# EAGLE design mini-meter-revd (EAGLE 6.5.0)
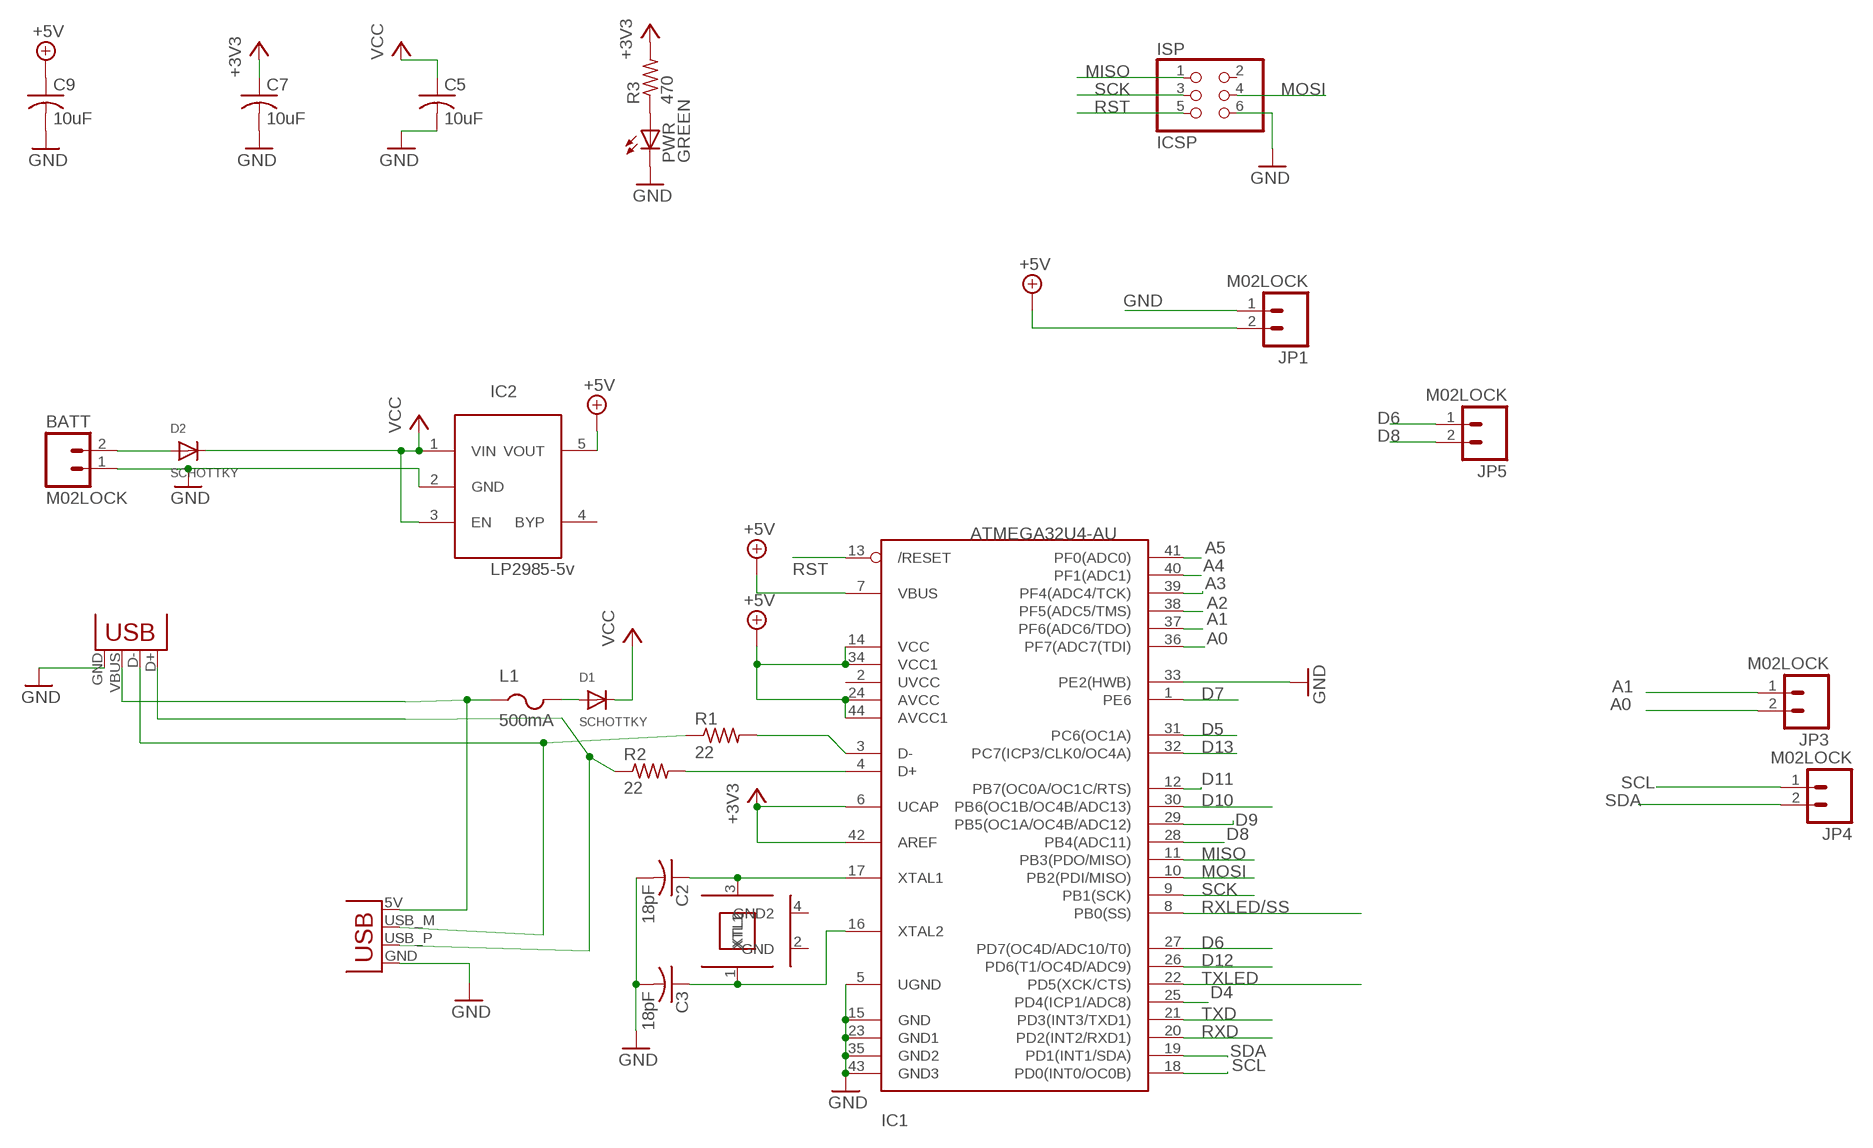
[diagram p0: schematic, sheet 1]

## Parts
BATT  M02LOCK  [1X02_LOCK]
C2  18pF  C-USC0805K  [C0805K]
C3  18pF  C-USC0805K  [C0805K]
C5  10uF  C-USC0805K  [C0805K]
C7  10uF  C-USC0805K  [C0805K]
C9  10uF  C-USC0805K  [C0805K]
D1  SCHOTTKY  DIODESOD-123  [SOD-123]
D2  SCHOTTKY  DIODESOD-123  [SOD-123]
IC1  ATMEGA32U4-AU  [TQFP44]
IC2  LP2985-5v  LP298XS  [SOT23-5L]
ISP  ICSP  PINHD-2X3  [2X03]
JP1  M02LOCK  [1X02_LOCK]
JP3  M02LOCK  [1X02_LOCK]
JP4  M02LOCK  [1X02_LOCK]
JP5  M02LOCK  [1X02_LOCK]
L1  500mA  PTCFUSE-1206  [R1206]
P1  USBPCB  [USB-A-PCB]
PWR  GREEN  LEDCHIPLED_0805  [CHIPLED_0805]
R1  22  R-US_R0805  [R0805]
R2  22  R-US_R0805  [R0805]
R3  470  R-US_R0805  [R0805]
X1  USB-MICROB  [USB-MICROB]
XTL1  16MHz  CRYSTAL-GND3X2  [CRYSTAL-SMD-3X2]

## Nets
+3V3: C7.1 IC1.6(UCAP) IC1.42(AREF) R3.2
+5V: C9.1 IC1.7(VBUS) IC1.14(VCC) IC1.24(AVCC) IC1.34(VCC1) IC1.44(AVCC1) IC2.5(VOUT) JP1.2
A0: IC1.36(PF7(ADC7(TDI)) JP3.2
A1: IC1.37(PF6(ADC6/TDO)) JP3.1
A2: IC1.38(PF5(ADC5/TMS))
A3: IC1.39(PF4(ADC4/TCK))
A4: IC1.40(PF1(ADC1))
A5: IC1.41(PF0(ADC0))
D4: IC1.25(PD4(ICP1/ADC8))
D5: IC1.31(PC6(OC1A))
D6: IC1.27(PD7(OC4D/ADC10/T0)) JP5.1
D7: IC1.1(PE6)
D8: IC1.28(PB4(ADC11)) JP5.2
D9: IC1.29(PB5(OC1A/OC4B/ADC12))
D10: IC1.30(PB6(OC1B/OC4B/ADC13))
D11: IC1.12(PB7(OC0A/OC1C/RTS))
D12: IC1.26(PD6(T1/OC4D/ADC9))
D13: IC1.32(PC7(ICP3/CLK0/OC4A))
GND: BATT.1 C2.2 C3.2 C5.2 C7.2 C9.2 IC1.5(UGND) IC1.15(GND) IC1.23(GND1) IC1.33(PE2(HWB)) IC1.35(GND2) IC1.43(GND3) IC2.2(GND) ISP.6 JP1.1 P1.GND PWR.C X1.GND
MISO: IC1.11(PB3(PDO/MISO)) ISP.1
MOSI: IC1.10(PB2(PDI/MISO)) ISP.4
N$1: PWR.A R3.1
N$2: P1.USB_P(D+) R2.1 X1.D+
N$3: IC1.3(D-) R1.2
N$4: IC1.4(D+) R2.2
N$5: P1.USB_M(D-) R1.1 X1.D-
N$7: BATT.2 D2.A
N$8: C2.1 IC1.17(XTAL1) XTL1.3(XTL2)
N$9: C3.1 IC1.16(XTAL2) XTL1.1(XTL1)
N$11: D1.A L1.2
RST: IC1.13(/RESET) ISP.5
RXD: IC1.20(PD2(INT2/RXD1))
RXLED/SS: IC1.8(PB0(SS))
SCK: IC1.9(PB1(SCK)) ISP.3
SCL: IC1.18(PD0(INT0/OC0B)) JP4.1
SDA: IC1.19(PD1(INT1/SDA)) JP4.2
TXD: IC1.21(PD3(INT3/TXD1))
TXLED: IC1.22(PD5(XCK/CTS))
VBUS: L1.1 P1.5V(VBUS) X1.VBUS
VCC: C5.1 D1.C D2.C IC2.1(VIN) IC2.3(EN)
Unconnected: IC1.2(UVCC) IC2.4(BYP) ISP.2 XTL1.2(GND) XTL1.4(GND2)

## Library data of the parts
BATT JP1 JP3-JP5 = SparkFun-Connectors:M02: Standard 2-pin 0.1" header. Use with - straight break away headers ( PRT-00116) - right angle break away headers (PRT-00553) - swiss pins (PRT-00743) - machine pins (PRT-00117) - female headers (PRT-00115) Molex polarized connector foot print use with: PRT-08233 with associated crimp pins and housings. 2.54_SCREWTERM for use with PRT-10571. 3.5mm Screw Terminal footprints for PRT-08084 5mm Screw Terminal footprints for use with PRT-08433
C2 C3 C5 C7 C9 = adafruit:C-US: CAPACITOR, American symbol
D1 D2 = adafruit:DIODE: Diode SMADIODE - SMA Surface Mount Package 20V 1A Schottky Diode Digikey: 641-1014-6-ND DO-1N4148 - Through Hole Small Current Diode SOD-123 20V 1 A (.5mV Vf) Schottky Diode - Digikey: MBRX120TPMSCT-ND SOD-323 10V 570mA (.38mV Vf, 3ns) Schottky Diode - Digikey: ZLLS410CT-ND SOD-523 30V 30mA Schottky Diode (RB751S-40TE61) - Digikey: RB751S-40TE61CT-ND SOT23-R/W - SOT23 Package (R = Solder Paste/Reflow Ovens, W = Hand-Soldering) BAT54Film 40V 300mA - Digikey: 497-7162-1-ND
IC1 = adaprog:ATMEGA32U4
IC2 = adafruit:LP298X
ISP = pinhead:PINHD-2X3: PIN HEADER
L1 = adafruit:PTCFUSE: PTC fuses, resettable thermistors
P1 = freetronics-master-v1:USB: USB Connectors USB-B-PTH is fully proven SKU : PRT-00139 USB-miniB is fully proven SKU : PRT-00587 USB-A-PCB is untested. USB-A-H is throughly reviewed, but untested. Spark Fun Electronics SKU : PRT-00437 USB-B-SMT is throughly reviewed, but untested. Needs silkscreen touching up. USB-A-S has not been used/tested USB-MB-H has not been used/tested
PWR = adafruit:LED: LED OSRAM: - CHIPLED LG R971, LG N971, LY N971, LG Q971, LY Q971, LO R971, LY R971 LH N974, LH R974 LS Q976, LO Q976, LY Q976 LO Q996 - Hyper CHIPLED LW Q18S LB Q993, LB Q99A, LB R99A - SideLED LS A670, LO A670, LY A670, LG A670, LP A670 LB A673, LV A673, LT A673, LW A673 LH A674 LY A675 LS A676, LA A676, LO A676, LY A676, LW A676 LS A679, LY A679, LG A679 - Hyper Micro SIDELED® LS Y876, LA Y876, LO Y876, LY Y876 LT Y87S - SmartLED LW L88C, LW L88S LB L89C, LB L89S, LG L890 LS L89K, LO L89K, LY L89K LS L896, LA L896, LO L896, LY L896 - TOPLED LS T670, LO T670, LY T670, LG T670, LP T670 LSG T670, LSP T670, LSY T670, LOP T670, LYG T670 LG T671, LOG T671, LSG T671 LB T673, LV T673, LT T673, LW T673 LH T674 LS T676, LA T676, LO T676, LY T676, LB T676, LH T676, LSB T676, LW T676 LB T67C, LV T67C, LT T67C, LS T67K, LO T67K, LY T67K, LW E67C LS E67B, LA E67B, LO E67B, LY E67B, LB E67C, LV E67C, LT E67C LW T67C LS T679, LY T679, LG T679 LS T770, LO T770, LY T770, LG T770, LP T770 LB T773, LV T773, LT T773, LW T773 LH T774 LS E675, LA E675, LY E675, LS T675 LS T776, LA T776, LO T776, LY T776, LB T776 LHGB T686 LT T68C, LB T68C - Hyper Mini TOPLED® LB M676 - Mini TOPLED Santana® LG M470 LS M47K, LO M47K, LY M47K Source: http://www.osram.convergy.de/
R1-R3 = adafruit:R-US_: RESISTOR, American symbol
X1 = SparkFun:USB: USB Connectors USB-B-PTH is fully proven SKU : PRT-00139 USB-miniB is fully proven SKU : PRT-00587 USB-A-PCB is untested. USB-A-H is throughly reviewed, but untested. Spark Fun Electronics SKU : PRT-00437 USB-B-SMT is throughly reviewed, but untested. Needs silkscreen touching up. USB-A-S has not been used/tested USB-MB-H has not been used/tested
XTL1 = freetronics-jon:CRYSTAL-GND

## Net classes
0 default: width 0.152 mm, drill 0.241 mm, clearance 0.152 mm

## Board
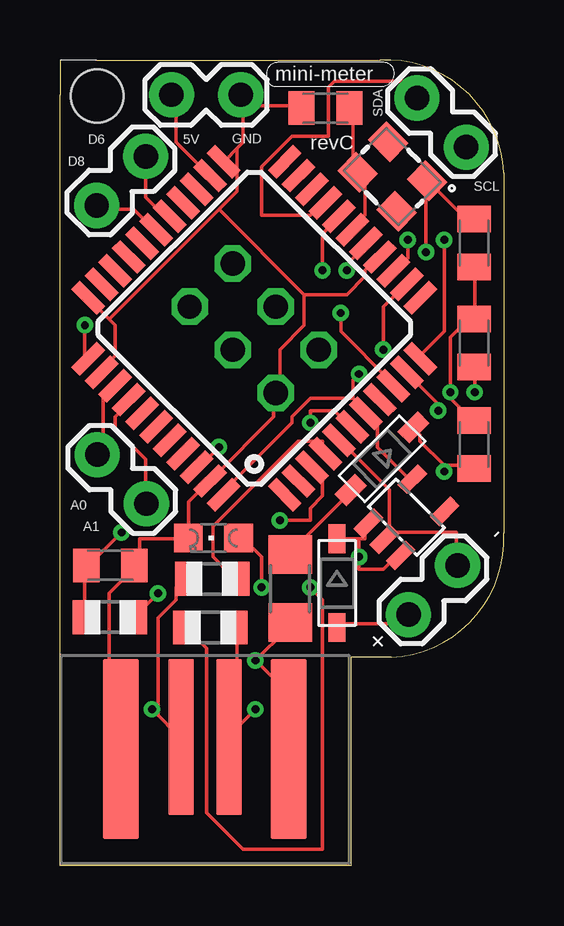
[diagram p1: board, top side]
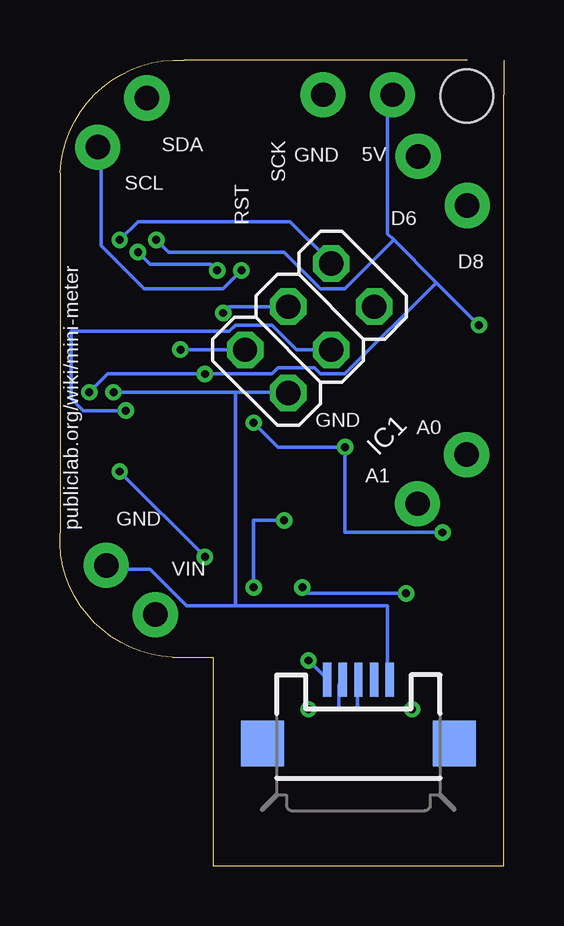
[diagram p2: board, bottom side, seen from below]

Size 18.52 x 33.58 mm. Coordinates in mm from the lower left corner, seen from the top.
Outline: 1.52,33.58 13.34,33.58 arc-90 18.52,28.88 18.52,13.87 arc-90 13.82,8.69 12.14,8.69 12.14,0 0,0 0,32.13 0,33.58
Copper layers (1*16): Top 0.0356mm / dielectric 1.5011mm / Bottom 0.0356mm
Design rules "LaenPCBOrder": minimum track width 6mil, minimum drill 13mil, track to track 6mil, track to pad 6mil, pad to pad 6mil, via to via 6mil, smd to smd 6mil, copper to edge 15mil, drill to drill 6mil, minimum pad ring 7mil, minimum via ring 7mil, stop-mask expansion 3mil, vias tented up to drill 0mil, thermal gap 10mil
Holes 2.2 mm at 1.55,32.08

### Footprints (pad centres in the part's own frame; a part is rotated, then mirrored left to right if it is on the bottom)
1X02_LOCK = drill 1.016 pad 1.88: 1 -0.178,0; 2 2.718,0
C0805K = smd 1.1 x 1.4: 1 -1,0; 2 1,0
SOD-123 = smd 1.2 x 0.7: A 1.85,0; C -1.85,0
TQFP44 = smd 1.5 x 0.5: 1 -5.8,4; 2 -5.8,3.2; 3 -5.8,2.4; 4 -5.8,1.6; 5 -5.8,0.8; 6 -5.8,0; 7 -5.8,-0.8; 8 -5.8,-1.6; 9 -5.8,-2.4; 10 -5.8,-3.2; 11 -5.8,-4; 23 5.8,-4; 24 5.8,-3.2; 25 5.8,-2.4; 26 5.8,-1.6; 27 5.8,-0.8; 28 5.8,0; 29 5.8,0.8; 30 5.8,1.6; 31 5.8,2.4; 32 5.8,3.2; 33 5.8,4 | smd 0.5 x 1.5: 12 -4,-5.8; 13 -3.2,-5.8; 14 -2.4,-5.8; 15 -1.6,-5.8; 16 -0.8,-5.8; 17 0,-5.8; 18 0.8,-5.8; 19 1.6,-5.8; 20 2.4,-5.8; 21 3.2,-5.8; 22 4,-5.8; 34 4,5.8; 35 3.2,5.8; 36 2.4,5.8; 37 1.6,5.8; 38 0.8,5.8; 39 0,5.8; 40 -0.8,5.8; 41 -1.6,5.8; 42 -2.4,5.8; 43 -3.2,5.8; 44 -4,5.8
SOT23-5L = smd 0.55 x 1.2: 1 -0.95,-1.3; 2 0,-1.3; 3 0.95,-1.3; 4 0.95,1.3; 5 -0.95,1.3
2X03 = drill 1.016 octagon: 1 -2.54,-1.27; 2 -2.54,1.27; 3 0,-1.27; 4 0,1.27; 5 2.54,-1.27; 6 2.54,1.27
R1206 = smd 1.6 x 1.803: 1 -1.422,0; 2 1.422,0
USB-A-PCB = smd 7.5 x 1.5: 5V -0.2,-3.5; GND -0.2,3.5 | smd 6.5 x 1.067: USB_M 0.3,-1; USB_P 0.3,1
CHIPLED_0805 = smd 1.2 x 1.2: A 0,-1.05; C 0,1.05
R0805 = smd 1.1 x 1.4: 1 -1,0; 2 1,0
USB-MICROB = smd 0.35 x 1.4: D+ 0,2.65; D- -0.65,2.65; GND 1.3,2.65; ID 0.65,2.65; VBUS -1.3,2.65 | smd 1.8 x 1.9: MT1 -4,0; MT2 4,0
CRYSTAL-SMD-3X2 = smd 1.3 x 1.1: 1 -1.15,-0.9; 2 1.15,-0.9; 3 1.15,0.9; 4 -1.15,0.9

### Placement (x,y rotation side)
BATT  16.46,12.4 225 top
C2  11.07,31.57 180 top
C3  17.27,25.96 270 top
C5  17.27,17.55 90 top
C7  2.11,12.52 0 top
C9  17.27,21.79 90 top
D1  13.44,16.97 225 top
D2  11.56,11.79 270 top
IC1  8.1,22.4 135 top
IC2  14.45,14.53 315 top
ISP  8.1,22.4 225 bottom
JP1  7.37,32.13 180 top
JP3  3.48,15.21 135 top
JP4  16.81,30.07 135 top
JP5  3.45,29.44 225 top
L1  9.6,11.56 90 top
P1  6.05,5.08 90 top
PWR  6.4,13.67 90 top
R1  6.27,9.93 180 top
R2  6.35,11.96 0 top
R3  2.08,10.36 180 top
X1  6.07,5.11 0 bottom
XTL1  13.87,28.73 135 top

### Tracks (layer width: path | path; a pad name or v marks a point on that pad's centre or on a via)
+3V3  (via drill 0.33)
  Top 0.152: R3.2 1.04,10.59 1.04,12.37 C7.1 1.3,12.62 v2.57,13.89 | v6.63,17.45 5.87,16.69 IC1.42 | v10.44,18.47 10.44,18.97 11.46,18.97 11.96,18.47 IC1.6
  Bottom 0.152: v2.57,13.89 6.63,13.89 v6.63,17.45 9.42,17.45 v10.44,18.47
+5V  (via drill 0.33)
  Top 0.152: IC2.5 14.5,16.18 13.23,17.45 13.23,18.47 12.98,18.72 IC1.7 12.73,18.97 12.22,19.48 | v17.3,19.74 17.3,20.75 C9.1 | v12.47,20.5 12.22,20.24 12.22,19.48 | 12.22,19.48 10.44,19.48 9.68,18.72 9.68,18.47 6.88,15.67 IC1.44 | v1.04,22.53 1.04,21.26 IC1.34 | v14.5,26.09 14.5,25.32 14,24.82 IC1.14 | IC1.24 6.12,28.88 4.85,30.15 4.85,31.93 JP1.2
  Bottom 0.152: v17.3,19.74 16.54,20.5 v12.47,20.5 9.68,20.5 9.42,20.75 7.9,20.75 7.65,20.5 6.63,20.5 2.82,24.31 | 4.6,26.09 4.85,26.34 4.85,31.93 JP1.2 | 4.6,26.09 2.82,24.31 | 2.82,24.31 v1.04,22.53 | v14.5,26.09 14,25.58 9.17,25.58 7.65,24.05 6.63,24.05 4.6,26.09
A0
  Top 0.152: IC1.36 2.06,19.99 1.8,19.74 1.8,17.2 JP3.2
A1
  Top 0.152: IC1.37 2.82,19.23 2.31,18.72 2.31,18.21 3.58,16.94 3.58,15.16 JP3.1
D6
  Top 0.152: IC1.27 4.34,27.1 3.58,27.86 3.58,29.39 JP5.1
D8
  Top 0.152: IC1.28 3.84,26.59 3.07,27.36 1.55,27.36 JP5.2
GND  (via drill 0.33)
  Top 0.152: 13.74,13.89 13.74,15.67 11.71,17.7 IC1.5 | 13.74,13.89 13.74,13.64 IC2.2 13.74,13.89 | 13.74,13.89 16.54,13.89 16.54,12.62 BATT.1 | 2.06,22.78 2.31,22.53 2.31,21.26 1.8,20.75 IC1.35 | 2.06,22.78 1.3,23.55 IC1.33 | 7.65,31.67 9.93,31.67 C2.2 | 7.65,31.67 7.65,31.93 JP1.1 7.65,31.67 | 7.39,29.9 7.65,30.15 7.65,31.67 | 7.39,29.9 6.88,29.39 IC1.23 | 6.63,27.36 7.39,28.12 7.39,29.9 | 6.63,27.36 2.06,22.78 | C5.2 17.04,18.72 16.28,19.48 v16.28,19.74 16.28,22.02 17.04,22.78 C9.2 17.3,23.04 17.3,24.82 C3.2 | 10.19,23.8 11.96,23.8 12.73,24.56 12.73,24.82 13.23,25.32 IC1.15 | 10.19,23.8 10.19,22.53 9.17,21.51 9.17,19.74 ISP.6 8.92,19.48 8.92,18.72 6.38,16.18 IC1.43 6.12,15.93 5.36,15.16 5.36,13.89 PWR.C 5.11,13.64 3.33,13.64 3.33,12.62 C7.2 3.07,12.37 2.06,11.35 2.06,5.26 2.31,5 P1.GND | 10.19,23.8 6.63,27.36
  Bottom 0.152: 11.2,10.85 13.23,10.85 14.76,12.37 16.54,12.37 BATT.1 | 11.2,10.85 4.85,10.85 4.85,7.8 X1.GND | 11.2,19.74 9.17,19.74 ISP.6 | 11.2,19.74 v16.28,19.74 | 11.2,19.74 11.2,10.85
MISO  (via drill 0.33)
  Top 0.152: v16.03,26.09 16.03,22.28 15.01,21.26 IC1.11
  Bottom 0.152: v16.03,26.09 15.27,26.85 8.92,26.85 7.39,25.32 ISP.1
MOSI  (via drill 0.33)
  Top 0.152: v15.77,18.97 15.77,19.23 14.5,20.5 IC1.10
  Bottom 0.152: v15.77,18.97 17.55,18.97 18.06,19.48 18.06,22.28 11.46,22.28 11.2,22.53 9.68,22.53 8.66,21.51 7.39,21.51 ISP.4
N$1  (via drill 0.33)
  Top 0.152: v8.41,11.61 8.41,12.88 7.65,13.64 PWR.A | v4.09,11.35 3.33,10.59 R3.1
  Bottom 0.152: v8.41,11.61 8.15,11.35 v4.09,11.35
N$2  (via drill 0.33)
  Top 0.152: 4.09,6.27 4.85,5.51 P1.USB_P | 4.09,6.27 v3.84,6.53 | 4.09,6.27 4.09,10.34 4.85,11.1 4.85,11.61 5.11,11.86 R2.1
  Bottom 0.152: v3.84,6.53 6.12,6.53 6.12,7.54 X1.D+
N$3  (via drill 0.33)
  Top 0.152: v10.44,11.61 10.95,11.1 10.95,0.69 7.65,0.69 6.12,2.21 6.12,9.07 5.36,9.83 R1.2 | v9.17,14.4 10.44,14.4 10.44,14.91 10.95,15.42 10.95,16.18 10.69,16.43 IC1.3
  Bottom 0.152: v10.44,11.61 10.44,14.4 v9.17,14.4
N$4
  Top 0.152: R2.2 7.14,12.12 6.38,12.88 6.38,14.15 9.93,17.7 10.95,17.7 10.95,17.2 IC1.4
N$5  (via drill 0.33)
  Top 0.152: 7.39,5.77 7.14,5.51 P1.USB_M 7.39,5.77 | 7.39,5.77 v8.15,6.53 | 7.39,5.77 7.39,9.83 R1.1
  Bottom 0.152: v8.15,6.53 6.88,6.53 6.88,7.54 X1.D-
N$7
  Top 0.152: D2.A 11.71,10.08 14.5,10.08 14.5,10.34 BATT.2
N$8
  Top 0.152: C2.1 12.22,31.42 12.22,29.13 XTL1.3 12.47,28.88 12.73,28.63 12.73,27.1 12.22,26.59 IC1.17
N$9  (via drill 0.33)
  Top 0.152: C3.1 17.04,26.85 15.52,28.37 XTL1.1 15.27,28.37 v15.27,25.58 | v11.96,24.82 11.96,25.07 12.73,25.83 IC1.16
  Bottom 0.152: v11.96,24.82 12.22,25.07 14.76,25.07 v15.27,25.58
N$11
  Top 0.152: D1.A 11.96,15.42 9.68,13.13 L1.2
RST  (via drill 0.33)
  Top 0.152: v13.49,21.51 13.49,23.29 14.25,24.05 IC1.13
  Bottom 0.152: v13.49,21.51 10.95,21.51 ISP.5
SCK  (via drill 0.33)
  Top 0.152: v11.71,23.04 11.71,22.28 13.74,20.24 IC1.9
  Bottom 0.152: v11.71,23.04 11.46,23.29 9.17,23.29 ISP.3
SCL  (via drill 0.33)
  Top 0.152: v10.95,24.82 10.95,26.34 11.46,26.85 IC1.18
  Bottom 0.152: v10.95,24.82 11.71,24.05 15.01,24.05 16.79,25.83 16.79,29.9 JP4.1
SDA
  Top 0.152: IC1.19 10.95,27.61 10.44,27.1 8.41,27.1 8.41,29.13 9.68,30.4 11.2,30.4 11.2,32.44 11.46,32.69 14.76,32.69 14.76,32.18 JP4.2
VBUS  (via drill 0.33)
  Top 0.152: L1.1 9.42,10.08 9.42,9.83 v8.15,8.56 9.42,7.29 9.42,5 P1.5V
  Bottom 0.152: v8.15,8.56 7.39,7.8 X1.VBUS
VCC  (via drill 0.33)
  Top 0.152: 12.47,13.64 12.73,13.64 12.73,14.15 IC2.1 | 12.47,13.64 11.71,13.64 D2.C | 12.47,13.64 v12.47,12.88 12.47,12.37 13.49,12.37 14,12.88 IC2.3 | 16.03,16.69 15.01,17.7 15.01,17.96 14.76,18.21 D1.C | 16.03,16.69 17.04,16.69 C5.1 | 16.03,16.69 v16.03,16.43
  Bottom 0.152: v16.03,16.43 v12.47,12.88

### Text on the board
tPlace: mini-meter | SDA | D6 | 5V | GND | revC | D8 | SCL | A0 | A1 | - | +
bPlace: 5V | GND | SDA | SCL | D6 | D8 | A0 | GND | A1 | GND | publiclab.org/wiki/mini-meter | VIN
bNames: SCK | RST